# EasyEDA schematic easyeda.json
TITLE: Trafficlight 2 SHR; REV: 1.0; Date: 2019-10-15; Sheet: 1/1; Drawn By: Simen Stensås; Company: NTNU
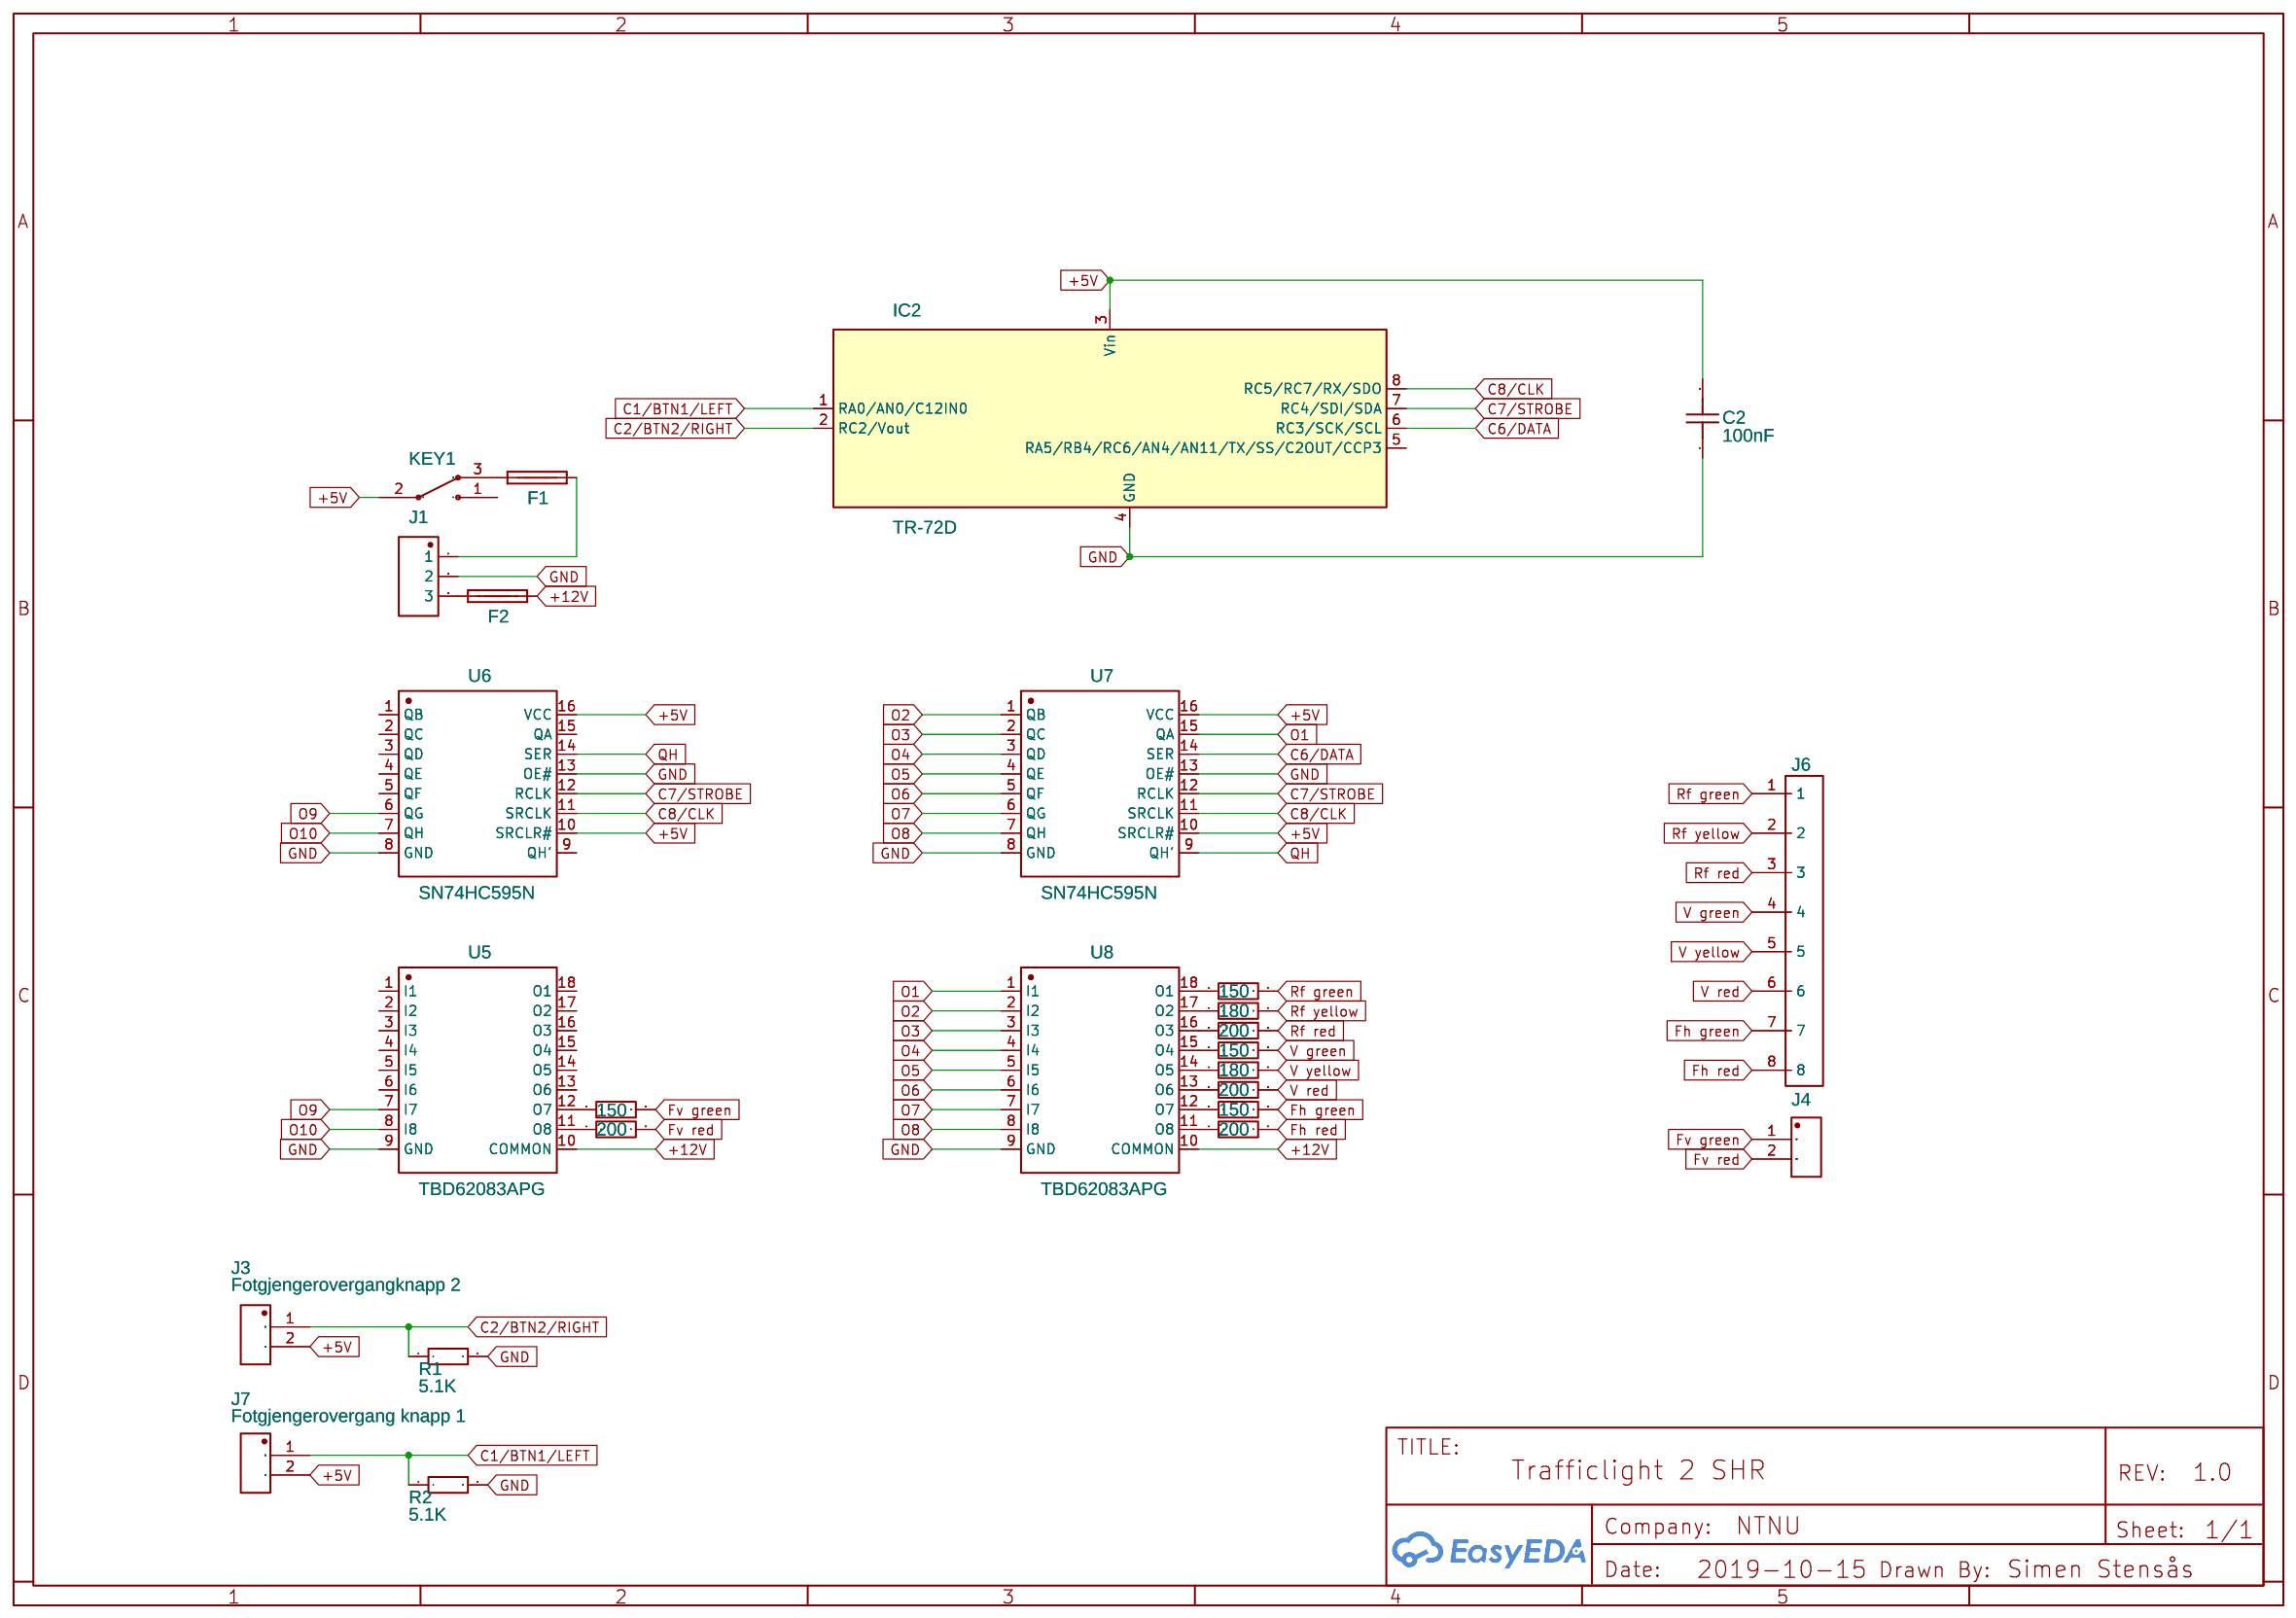
[diagram p0: schematic sheet]

## Parts
C2  100nF  [1210]
F1  NO  [OMF_125]
F2  NO  [OMF_125]
IC2  TR-72D  [IQRF_KON-SIM-01]
J1  KF127_3P_5.08  [KF127_3P_5.08]
J3  Fotgjengerovergangknapp 2  [KF127_2P_5.08]
J4  KF127_2P_5.08  [KF127_2P_5.08]
J6  KF127-8P  [KF127-8P]
J7  Fotgjengerovergang knapp 1  [KF127_2P_5.08]
KEY1  MSK-11027 Toggle Switches  [MSK-11027]
R1  5.1K  [1206]
R2  5.1K  [1206]
R3  150  [1206]
R4  200  [1206]
R5  200  [1206]
R6  200  [1206]
R7  200  [1206]
R16  180  [1206]
R17  180  [1206]
R18  150  [1206]
R19  150  [1206]
R20  150  [1206]
U5  TBD62083APG  [DIP-18]
U6  SN74HC595N  [DIP-16_L19.8-W6.5-P2.54-LS7.6-BL]
U7  SN74HC595N  [DIP-16_L19.8-W6.5-P2.54-LS7.6-BL]
U8  TBD62083APG  [DIP-18]

## Library data of the parts
C2 = 1210B106K100CT: Supplier: LCSC; Supplier Part: C304011; Manufacturer: Huaxin S&T; Contributor: LCSC
F1 F2 = -: Manufacturer Part: 3403.0015.11; Supplier: Mouser; Supplier Part: 693-3403.0015.11; link: https://www.mouser.co.uk/ProductDetail/Schurter/3403001511?qs=sGAEpiMZZMtxU2g%2f1juGqdRmCQF0%252bT4VUkZkHB0fJk4%3d; Contributor: romiksm
IC2 = -: Contributor: Simen Stensas; license: https://www.gnu.org/licenses/lgpl-2.1.html
J1 = -: Manufacturer: Kefa Electronics; Contributor: GrahamG
J3 J4 J7 = -: Manufacturer: Kefa Electronics; Manufacturer Part: KF127L-5.08; Contributor: GrahamG
J6 = -: Manufacturer: CIXI KAIFEN ELECTRONICS CO,. LTDA.; Contributor: milton.sanchez.alban
KEY1 = -: Supplier Part: C21381; Supplier: LCSC; Manufacturer: ReliaPro; image: http://image.lceda.cn/szlcsc/C21381.jpg
R1 R2 = RMC12065.1K1%N: Supplier: LCSC; Supplier Part: C325932; Manufacturer: Tyohm; Contributor: LCSC
R3 R18-R20 = RC1206JR-07160RL: Supplier: LCSC; Manufacturer: YAGEO; Supplier Part: C137196
R4-R7 = QR1206J200RP05: Supplier: LCSC; Manufacturer: EVER OHMS; Contributor: LCSC; Supplier Part: C149886
R16 R17 = CR1206-FX-1800ELF: Supplier: LCSC; Supplier Part: C204708; Manufacturer: BOURNS; Contributor: LCSC
U5 U8 = -: Supplier: LCSC; Manufacturer: TOSHIBA; Contributor: LCSC; Supplier Part: C114143
U6 U7 = -: Supplier: LCSC; Manufacturer: TI; image: //image.lceda.cn/szlcsc/C78711.jpg; Supplier Part: C78711

## Nets
+5V: C2.2 IC2.3(Vin) J3.2(PIN2) J7.2(PIN2) KEY1.2 U6.10(SRCLR#) U6.16(VCC) U7.10(SRCLR#) U7.16(VCC)
+12V: F2.2 U5.10(COMMON) U8.10(COMMON)
GND: C2.1 IC2.4(GND) J1.2 R1.2 R2.2 U5.9(GND) U6.8(GND) U6.13(OE#) U7.8(GND) U7.13(OE#) U8.9(GND)
C1/BTN1/LEFT: IC2.1(RA0/AN0/C12IN0) J7.1(PIN1) R2.1
C2/BTN2/RIGHT: IC2.2(RC2/Vout) J3.1(PIN1) R1.1
C6/DATA: IC2.6(RC3/SCK/SCL) U7.14(SER)
C7/STROBE: IC2.7(RC4/SDI/SDA) U6.12(RCLK) U7.12(RCLK)
C8/CLK: IC2.8(RC5/RC7/RX/SDO) U6.11(SRCLK) U7.11(SRCLK)
Fh green: J6.7 R18.2
Fh red: J6.8 R5.2
Fv green: J4.1(PIN1) R3.2
Fv red: J4.2(PIN2) R4.2
O1: U7.15(QA) U8.1(I1)
O2: U7.1(QB) U8.2(I2)
O3: U7.2(QC) U8.3(I3)
O4: U7.3(QD) U8.4(I4)
O5: U7.4(QE) U8.5(I5)
O6: U7.5(QF) U8.6(I6)
O7: U7.6(QG) U8.7(I7)
O8: U7.7(QH) U8.8(I8)
O9: U5.7(I7) U6.6(QG)
O10: U5.8(I8) U6.7(QH)
QH: U6.14(SER) U7.9(QH')
Rf green: J6.1 R20.2
Rf red: J6.3 R7.2
Rf yellow: J6.2 R17.2
V green: J6.4 R19.2
V red: J6.6 R6.2
V yellow: J6.5 R16.2
Net-(F1-1): F1.1 KEY1.3
Net-(F1-2): F1.2 J1.1
Net-(F2-1): F2.1 J1.3
Net-(R3-1): R3.1 U5.12(O7)
Net-(R4-1): R4.1 U5.11(O8)
Net-(R5-1): R5.1 U8.11(O8)
Net-(R6-1): R6.1 U8.13(O6)
Net-(R7-1): R7.1 U8.16(O3)
Net-(R16-1): R16.1 U8.14(O5)
Net-(R17-1): R17.1 U8.17(O2)
Net-(R18-1): R18.1 U8.12(O7)
Net-(R19-1): R19.1 U8.15(O4)
Net-(R20-1): R20.1 U8.18(O1)

Not connected (* = marked no-connect by the designer): IC2 5(RA5/RB4/RC6/AN4/AN11/TX/SS/C2OUT/CCP3); KEY1 1; U5 1(I1) 2(I2) 3(I3) 4(I4) 5(I5) 6(I6) 13(O6) 14(O5) 15(O4) 16(O3) 17(O2) 18(O1); U6 1(QB) 2(QC) 3(QD) 4(QE) 5(QF) 9(QH') 15(QA)
